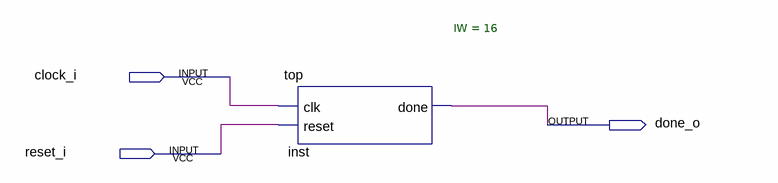
[diagram p0: schematic sheet]
// Quartus schematic schematic.bdf as structural Verilog: 1 symbols, 3 pins
module schematic (
  input  clock_i,
  input  reset_i,
  output done_o
);

  top #(.IW(16)) inst (.clk(clock_i), .reset(reset_i), .done(done_o));
endmodule
